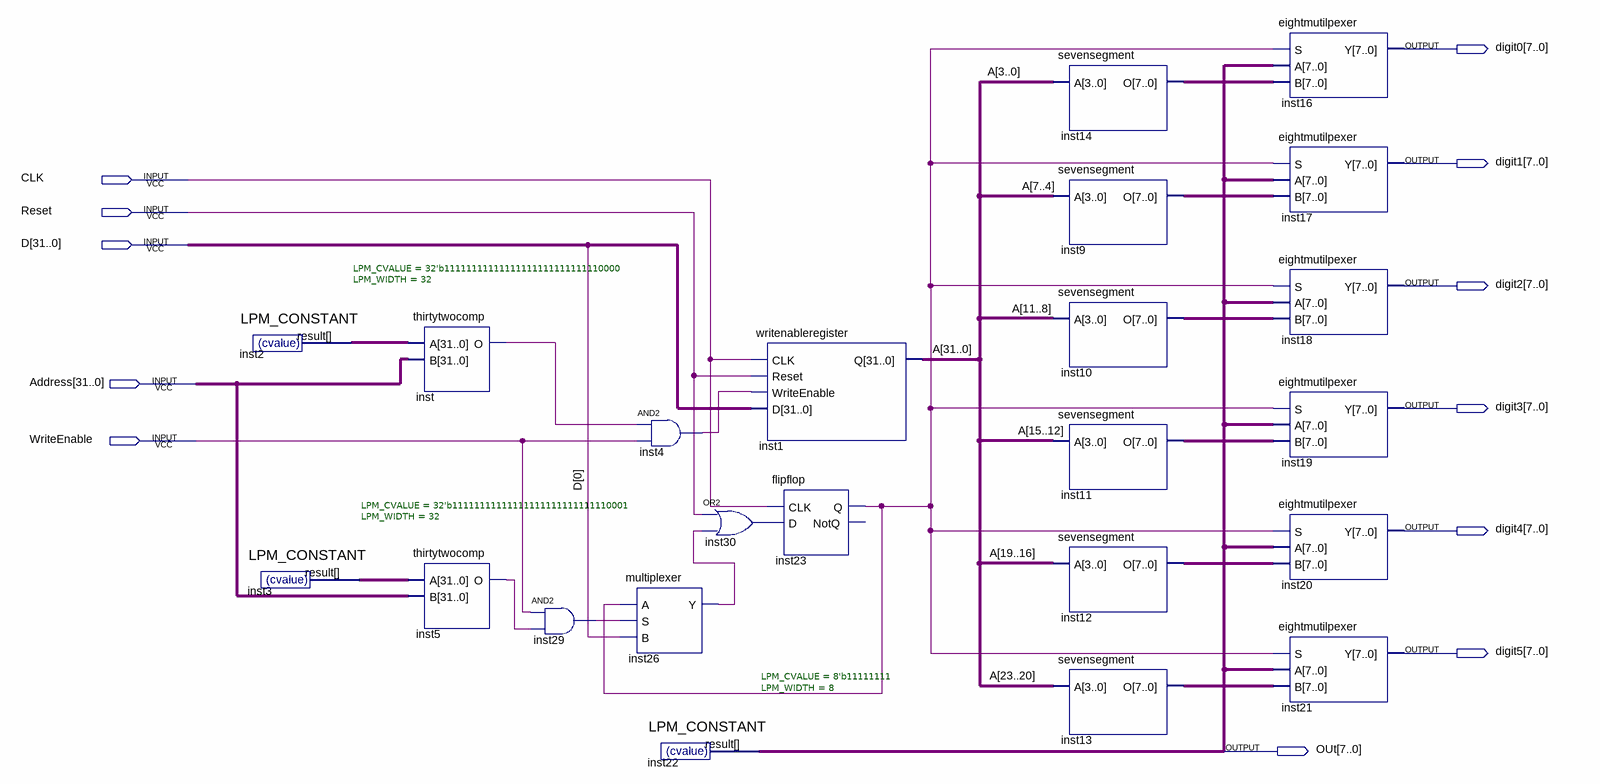
[diagram p0: schematic sheet]
// Quartus schematic displaydriver.bdf as structural Verilog: 23 symbols, 12 pins
module displaydriver (
  input  CLK,
  input  Reset,
  input  [31:0] D,
  input  [31:0] Address,
  input  WriteEnable,
  output [7:0] digit0,
  output [7:0] digit1,
  output [7:0] digit2,
  output [7:0] digit3,
  output [7:0] digit4,
  output [7:0] digit5,
  output [7:0] OUt
);

  wire inst4_out, inst5_o, inst23_q, inst26_y, inst29_out, inst30_out, inst_o;
  wire [7:0] inst9_o, inst10_o, inst11_o, inst12_o, inst13_o, inst14_o;
  wire [31:0] A, inst2_result, inst3_result;

  LPM_CONSTANT #(.LPM_CVALUE(32'b11111111111111111111111111110000), .LPM_WIDTH(32)) inst2 (.result(inst2_result));
  LPM_CONSTANT #(.LPM_CVALUE(32'b11111111111111111111111111110001), .LPM_WIDTH(32)) inst3 (.result(inst3_result));
  thirtytwocomp inst (.A(inst2_result), .B(Address), .O(inst_o));
  thirtytwocomp inst5 (.A(inst3_result), .B(Address), .O(inst5_o));
  and inst29 (inst29_out, WriteEnable, inst5_o);
  multiplexer inst26 (.A(inst23_q), .S(inst29_out), .B(D[0]), .Y(inst26_y));
  and inst4 (inst4_out, inst_o, WriteEnable);
  LPM_CONSTANT #(.LPM_CVALUE(8'b11111111), .LPM_WIDTH(8)) inst22 (.result(OUt));
  writenableregister inst1 (.CLK(CLK), .Reset(Reset), .WriteEnable(inst4_out), .D(D), .Q(A));
  or inst30 (inst30_out, Reset, inst26_y);
  flipflop inst23 (.CLK(CLK), .D(inst30_out), .Q(inst23_q));  // open: NotQ
  sevensegment inst14 (.A(A[3:0]), .O(inst14_o));
  sevensegment inst9 (.A(A[7:4]), .O(inst9_o));
  sevensegment inst10 (.A(A[11:8]), .O(inst10_o));
  sevensegment inst11 (.A(A[15:12]), .O(inst11_o));
  sevensegment inst12 (.A(A[19:16]), .O(inst12_o));
  sevensegment inst13 (.A(A[23:20]), .O(inst13_o));
  eightmutilpexer inst16 (.S(inst23_q), .A(OUt), .B(inst14_o), .Y(digit0));
  eightmutilpexer inst17 (.S(inst23_q), .A(OUt), .B(inst9_o), .Y(digit1));
  eightmutilpexer inst18 (.S(inst23_q), .A(OUt), .B(inst10_o), .Y(digit2));
  eightmutilpexer inst19 (.S(inst23_q), .A(OUt), .B(inst11_o), .Y(digit3));
  eightmutilpexer inst20 (.S(inst23_q), .A(OUt), .B(inst12_o), .Y(digit4));
  eightmutilpexer inst21 (.S(inst23_q), .A(OUt), .B(inst13_o), .Y(digit5));
endmodule
